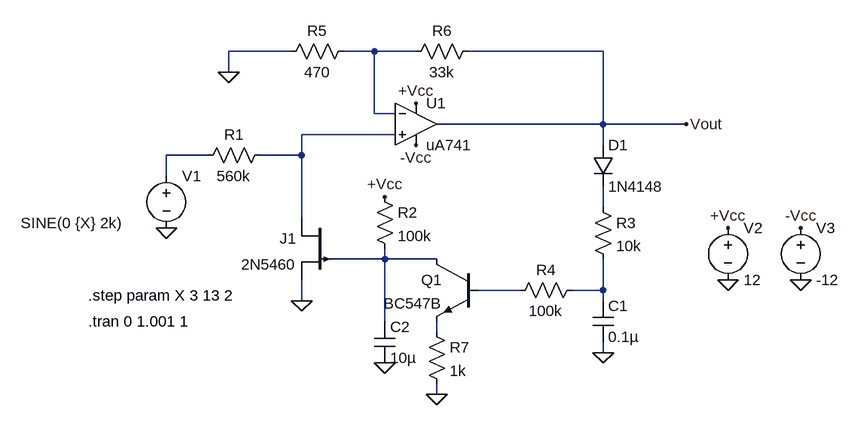
[diagram p0: schematic new_agc_jfet.asc]
new_agc_jfet.asc, the LTspice schematic file:
Version 4
SHEET 1 1104 680
WIRE 96 -160 0 -160
WIRE 224 -160 176 -160
WIRE 288 -160 224 -160
WIRE 576 -160 368 -160
WIRE 0 -128 0 -160
WIRE 224 -64 224 -160
WIRE 256 -64 224 -64
WIRE 576 -48 576 -160
WIRE 576 -48 320 -48
WIRE 704 -48 576 -48
WIRE 256 -32 112 -32
WIRE 576 -16 576 -48
WIRE -32 0 -96 0
WIRE 112 0 112 -32
WIRE 112 0 48 0
WIRE -96 32 -96 0
WIRE 576 80 576 48
WIRE 112 96 112 0
WIRE 240 160 240 144
WIRE 240 160 160 160
WIRE 320 160 240 160
WIRE 448 208 384 208
WIRE 576 208 576 160
WIRE 576 208 528 208
WIRE 112 224 112 192
WIRE 576 224 576 208
WIRE 240 256 240 160
WIRE 320 272 320 256
WIRE 576 304 576 288
WIRE 320 368 320 352
FLAG -96 112 0
FLAG 112 224 0
FLAG 320 368 0
FLAG 704 -48 Vout
FLAG 0 -128 0
FLAG 288 -80 +Vcc
FLAG 288 -16 -Vcc
FLAG 240 64 +Vcc
FLAG 768 192 0
FLAG 880 192 0
FLAG 768 112 +Vcc
FLAG 880 112 -Vcc
FLAG 240 320 0
FLAG 576 304 0
SYMBOL voltage -96 16 R0
WINDOW 3 -224 88 Left 2
WINDOW 123 0 0 Left 0
WINDOW 39 0 0 Left 0
SYMATTR Value SINE(0 {X} 2k)
SYMATTR InstName V1
SYMBOL res 64 -16 R90
WINDOW 0 0 56 VBottom 2
WINDOW 3 32 56 VTop 2
SYMATTR InstName R1
SYMATTR Value 560k
SYMBOL pjf 160 96 M0
SYMATTR InstName J1
SYMATTR Value 2N5460
SYMBOL res 224 48 R0
SYMATTR InstName R2
SYMATTR Value 100k
SYMBOL npn 384 160 M0
SYMATTR InstName Q1
SYMATTR Value BC547B
SYMBOL OpAmps\\uA741 288 -112 R0
SYMATTR InstName U1
SYMBOL res 192 -176 R90
WINDOW 0 0 56 VBottom 2
WINDOW 3 32 56 VTop 2
SYMATTR InstName R5
SYMATTR Value 470
SYMBOL res 384 -176 R90
WINDOW 0 0 56 VBottom 2
WINDOW 3 32 56 VTop 2
SYMATTR InstName R6
SYMATTR Value 33k
SYMBOL voltage 768 96 R0
WINDOW 123 0 0 Left 0
WINDOW 39 0 0 Left 0
SYMATTR InstName V2
SYMATTR Value 12
SYMBOL voltage 880 96 R0
WINDOW 123 0 0 Left 0
WINDOW 39 0 0 Left 0
SYMATTR InstName V3
SYMATTR Value -12
SYMBOL cap 224 256 R0
SYMATTR InstName C2
SYMATTR Value 10µ
SYMBOL diode 560 -16 R0
SYMATTR InstName D1
SYMATTR Value 1N4148
SYMBOL res 560 64 R0
SYMATTR InstName R3
SYMATTR Value 10k
SYMBOL res 544 192 R90
WINDOW 0 0 56 VBottom 2
WINDOW 3 32 56 VTop 2
SYMATTR InstName R4
SYMATTR Value 100k
SYMBOL cap 560 224 R0
SYMATTR InstName C1
SYMATTR Value 0.1µ
SYMBOL res 304 256 R0
SYMATTR InstName R7
SYMATTR Value 1k
TEXT -216 216 Left 2 !.step param X 3 13 2
TEXT -216 256 Left 2 !.tran 0 1.001 1

The netlist it stands for:
* new_agc_jfet.asc
V1 N003 0 SINE(0 {X} 2k)
R1 N002 N003 560k
J1 N002 N005 0 2N5460
R2 +Vcc N005 100k
Q1 N005 N006 N008 0 BC547B
XU1 N002 N001 +Vcc -Vcc Vout uA741  ; pins In+ In- V+ V- OUT
R5 N001 0 470
R6 Vout N001 33k
V2 +Vcc 0 12
V3 -Vcc 0 -12
C2 N005 0 10µ
D1 Vout N004 1N4148
R3 N004 N007 10k
R4 N007 N006 100k
C1 N007 0 0.1µ
R7 N008 0 1k
.model D D
.lib standard.dio
.model NPN NPN
.model PNP PNP
.lib standard.bjt
.model NJF NJF
.model PJF PJF
.lib standard.jft
.step param X 3 13 2
.tran 0 1.001 1
.backanno
.end